# Altium schematic sheet Mach_do_dong phuong an cu.SchDoc: Mạch cảm biến dòng và áp
size A3; Address1: Lớp học; Address2: thiết kế PCB nâng cao; Address3: tại Elec2PCB.com; Address4: 0905912019; SheetNumber: 1; SheetTotal: 1
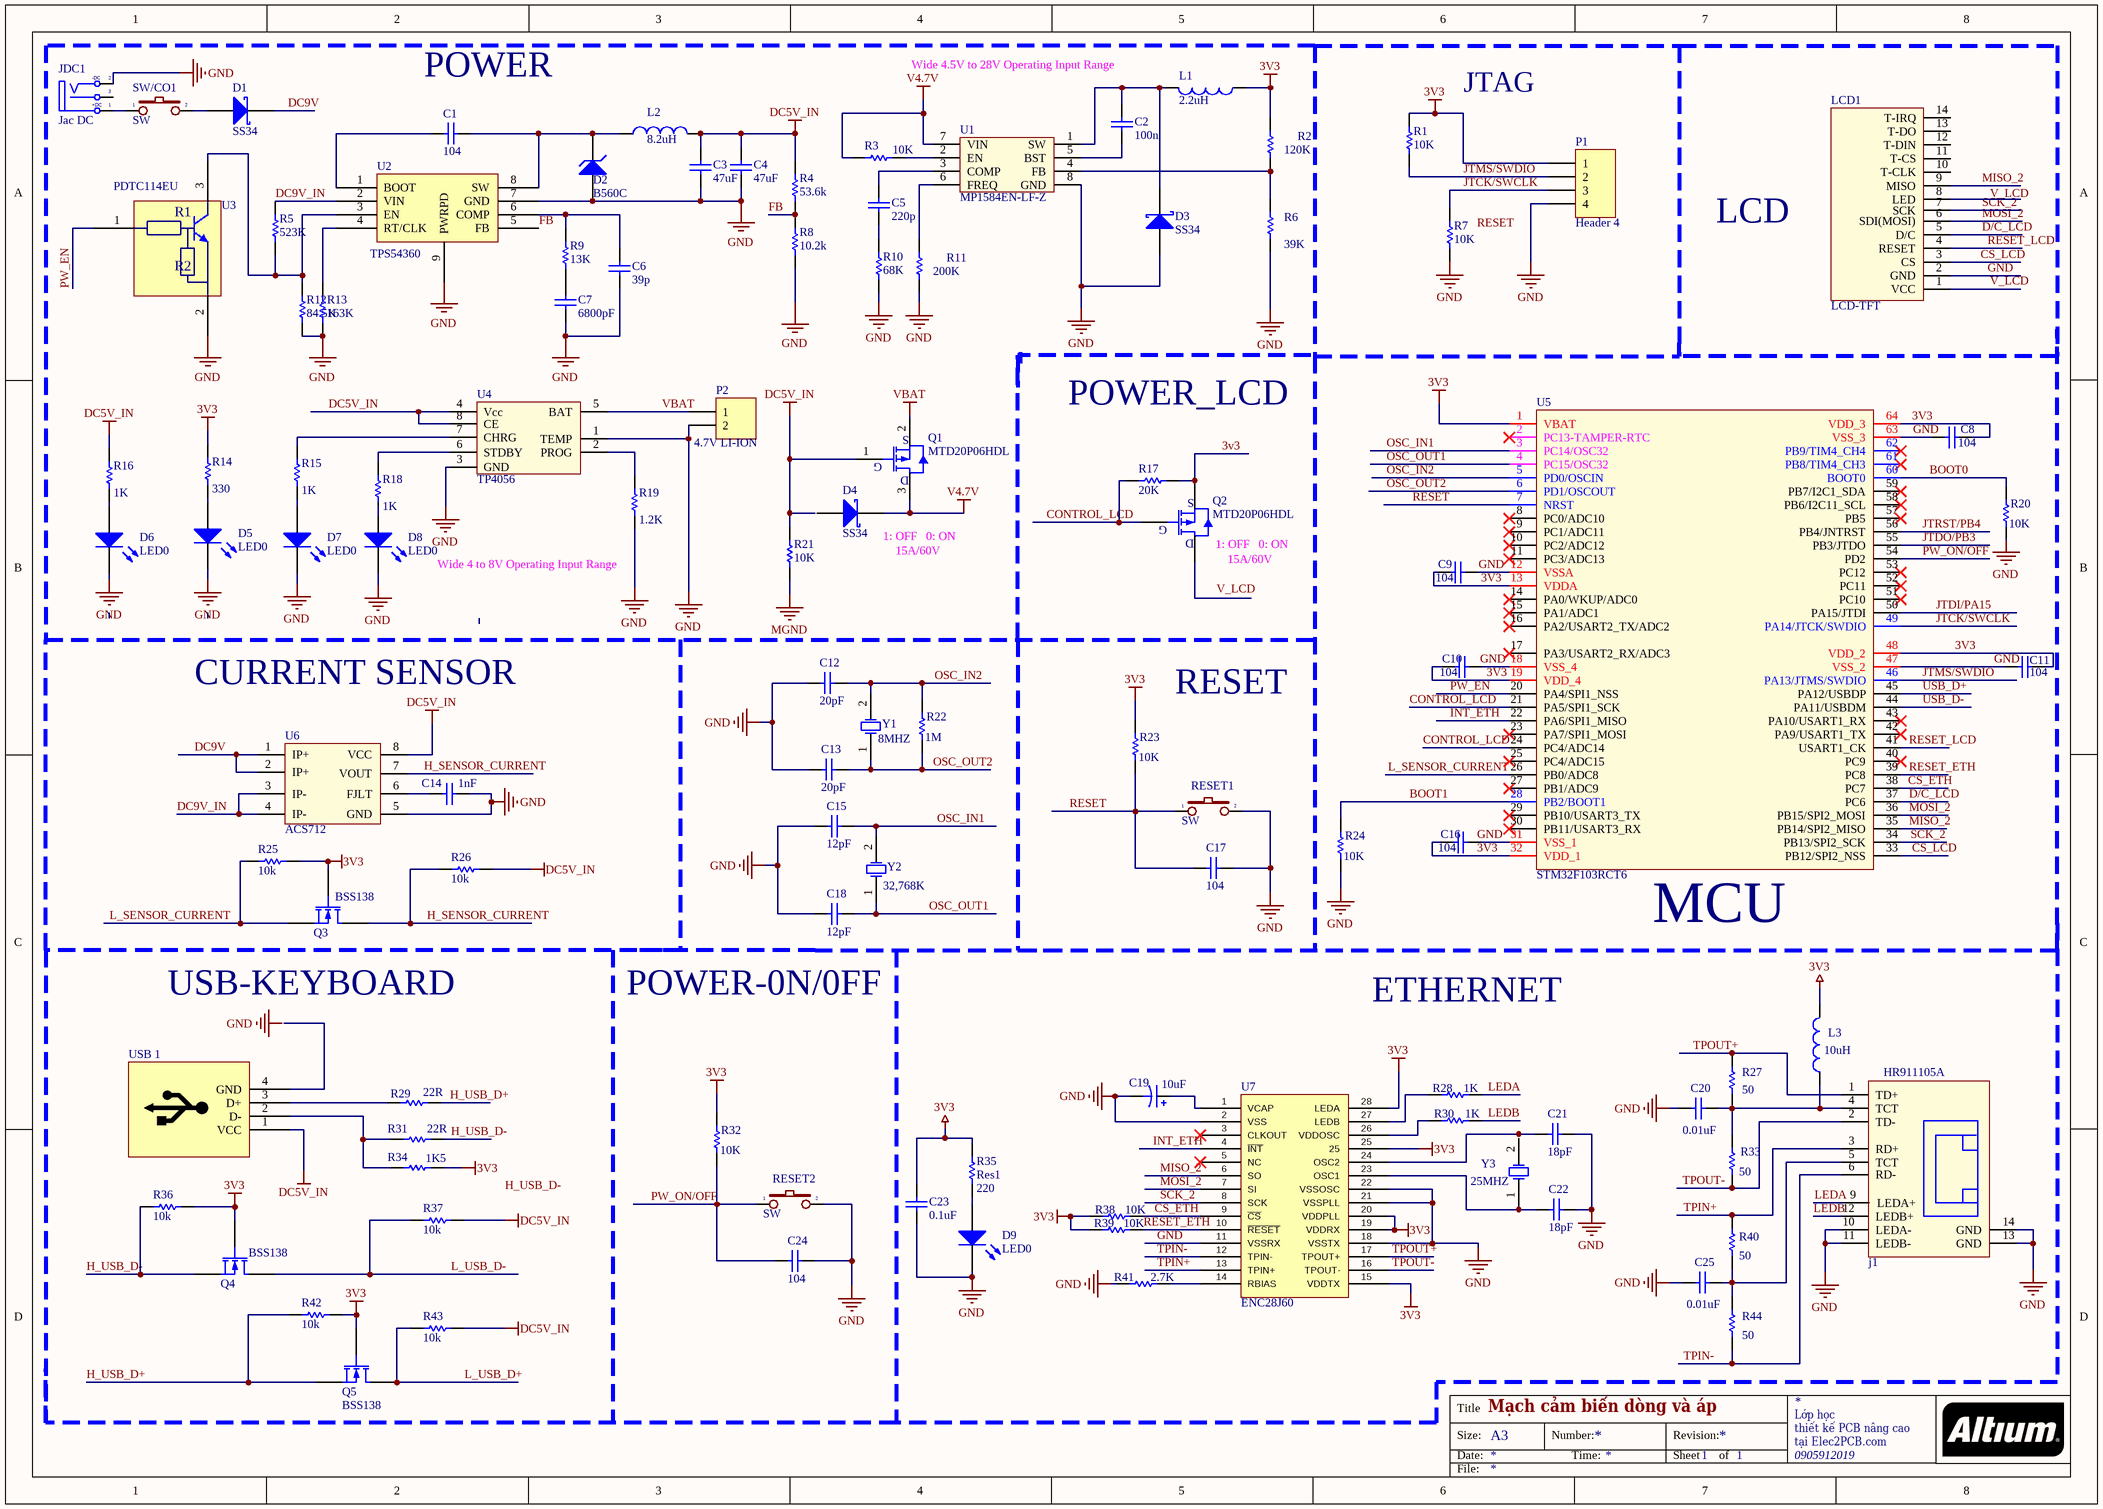
[diagram p0: Mach_do_dong phuong an cu.SchDoc]

## Parts
C1  value 104  [0805]  (hidden comment: Cap)
C2  value 100n  [RAD-0.3]  (hidden comment: Cap)
C3  value 47uF  [0805]  (hidden comment: Cap)
C4  value 47uF  [0805]  (hidden comment: Cap)
C5  value 220p  [RAD-0.3]  (hidden comment: Cap)
C6  value 39p  [0805]  (hidden comment: Cap)
C7  value 6800pF  [0805]  (hidden comment: Cap)
C8  value 104  [RAD-0.3]  (hidden comment: Cap)
C9  value 104  [RAD-0.3]  (hidden comment: Cap)
C10  value 104  [RAD-0.3]  (hidden comment: Cap)
C11  value 104  [RAD-0.3]  (hidden comment: Cap)
C12  value 20pF  [RAD-0.3]  (hidden comment: Cap)
C13  value 20pF  [RAD-0.3]  (hidden comment: Cap)
C14  value 1nF  [RAD-0.3]  (hidden comment: Cap)
C15  value 12pF  [RAD-0.3]  (hidden comment: Cap)
C16  value 104  [RAD-0.3]  (hidden comment: Cap)
C17  value 104  [RAD-0.3]  (hidden comment: Cap)
C18  value 12pF  [RAD-0.3]  (hidden comment: Cap)
C19  value 10uF  [RB7.6-15]  (hidden comment: Cap Pol1)
C20  value 0.01uF  [RAD-0.3]  (hidden comment: Cap)
C21  value 18pF  [RAD-0.3]  (hidden comment: Cap)
C22  value 18pF  [RAD-0.3]  (hidden comment: Cap)
C23  value 0.1uF  [RAD-0.3]  (hidden comment: Cap)
C24  value 104  [RAD-0.3]  (hidden comment: Cap)
C25  value 0.01uF  [RAD-0.3]  (hidden comment: Cap)
D1  SS34  [SMB]
D2  B560C  [D-SMC]
D3  SS34  [SMB]
D4  SS34  [SMB]
D5  LED0  [LED-0]
D6  LED0  [LED-0]
D7  LED0  [LED-0]
D8  LED0  [LED-0]
D9  LED0  [LED-0]
j1  HR911105A
JDC1  Jac DC  [DC-IN]
L1  value 2.2uH  [0402-A]  (hidden comment: Inductor)
L2  value 8.2uH  [L -smd]  (hidden comment: Inductor)
L3  value 10uH  [0402-A]  (hidden comment: Inductor)
LCD1  LCD-TFT
P1  Header 4  [HDR1X4]
P2  4.7V LI-ION  [HDR1X2]
Q1  MTD20P06HDL  [8# IRLML9301- TRPbF]
Q2  MTD20P06HDL  [8# IRLML9301- TRPbF]
Q3  BSS138  [E3]
Q4  BSS138  [E3]
Q5  BSS138  [E3]
R1  value 10K  [RESC2012(0805)]  (hidden comment: Res1)
R2  value 120K  [RESC2012(0805)]  (hidden comment: Res1)
R3  value 10K  [RESC2012(0805)]  (hidden comment: Res1)
R4  value 53.6k  [RESC2012(0805)]  (hidden comment: Res1)
R5  value 523K  [RESC2012(0805)]  (hidden comment: Res1)
R6  value 39K  [RESC2012(0805)]  (hidden comment: Res1)
R7  value 10K  [RESC2012(0805)]  (hidden comment: Res1)
R8  value 10.2k  [RESC2012(0805)]  (hidden comment: Res1)
R9  value 13K  [RESC2012(0805)]  (hidden comment: Res1)
R10  value 68K  [RESC2012(0805)]  (hidden comment: Res1)
R11  value 200K  [RESC2012(0805)]  (hidden comment: Res1)
R12  value 84.5K  [RESC2012(0805)]  (hidden comment: Res1)
R13  value 163K  [RESC2012(0805)]  (hidden comment: Res1)
R14  value 330  [RESC2012(0805)]  (hidden comment: Res1)
R15  value 1K  [RESC2012(0805)]  (hidden comment: Res1)
R16  value 1K  [RESC2012(0805)]  (hidden comment: Res1)
R17  value 20K  [RESC2012(0805)]  (hidden comment: Res1)
R18  value 1K  [RESC2012(0805)]  (hidden comment: Res1)
R19  value 1.2K  [RESC2012(0805)]  (hidden comment: Res1)
R20  value 10K  [RESC2012(0805)]  (hidden comment: Res1)
R21  10K  [Res 0603 SMD]
R22  value 1M  [RESC2012(0805)]  (hidden comment: Res1)
R23  value 10K  [RESC2012(0805)]  (hidden comment: Res1)
R24  value 10K  [RESC2012(0805)]  (hidden comment: Res1)
R25  value 10k  [RESC2012(0805)]  (hidden comment: Res1)
R26  value 10k  [RESC2012(0805)]  (hidden comment: Res1)
R27  value 50  [RESC2012(0805)]  (hidden comment: Res1)
R28  value 1K  [RESC2012(0805)]  (hidden comment: Res1)
R29  value 22R  [RESC2012(0805)]  (hidden comment: Res1)
R30  value 1K  [RESC2012(0805)]  (hidden comment: Res1)
R31  value 22R  [RESC2012(0805)]  (hidden comment: Res1)
R32  value 10K  [RESC2012(0805)]  (hidden comment: Res1)
R33  value 50  [RESC2012(0805)]  (hidden comment: Res1)
R34  value 1K5  [RESC2012(0805)]  (hidden comment: Res1)
R35  Res1  value 220  [RESC2012(0805)]
R36  value 10k  [RESC2012(0805)]  (hidden comment: Res1)
R37  value 10k  [RESC2012(0805)]  (hidden comment: Res1)
R38  value 10K  [RESC2012(0805)]  (hidden comment: Res1)
R39  value 10K  [RESC2012(0805)]  (hidden comment: Res1)
R40  value 50  [RESC2012(0805)]  (hidden comment: Res1)
R41  value 2.7K  [RESC2012(0805)]  (hidden comment: Res1)
R42  value 10k  [RESC2012(0805)]  (hidden comment: Res1)
R43  value 10k  [RESC2012(0805)]  (hidden comment: Res1)
R44  value 50  [RESC2012(0805)]  (hidden comment: Res1)
RESET1  SW  [SW2]
RESET2  SW  [SW2]
SW/CO1  SW  [SW2]
U1  MP1584EN-LF-Z
U2  TPS54360
U3  PDTC114EU
U4  TP4056
U5  STM32F103RCT6
U6  ACS712
U7  ENC28J60  [SOP_28M_127]
USB_1  USB  [USB-B-STRANGE]  (value not drawn)
Y1  8MHZ  [R38]
Y2  32,768K  [R38]
Y3  25MHZ  [R38]

## Nets
3V3: C8.2 C9.1 C10.1 C11.2 C16.1 C23.2 L1.1 L3.2 P1.1 Q2.2(S) Q3.2(G) Q4.2(G) Q5.2(G) R1.1 R2.1 R14.2 R17.2 R23.2 R25.2 R32.2 R34.1 R35.2 R36.2 R38.2 R39.2 R42.2 U5.1(VBAT) U5.13(VDDA) U5.19(VDD_4) U5.32(VDD_1) U5.48(VDD_2) U5.64(VDD_3) U7.15(VDDTX) U7.19(VDDRX) U7.20(VDDPLL) U7.25 U7.28(LEDA)
DC5V_IN: C3.1 C4.1 L2.2 Q1.1(G) R4.2 R16.2 R21.1 R26.2 R37.2 R43.2 U4.4(Vcc) U4.8(CE) U6.8(VCC) USB_1.1(VCC)
GND: C3.2 C4.2 C6.2 C7.2 C8.1 C9.2 C11.1 C12.1 C13.1 C14.2 C15.1 C17.2 C18.1 C19.2 C20.1 C21.1 C22.1 C23.1 C24.2 C25.1 D2.1(A) D3.1(A) D5.2(K) D6.2(K) D7.2(K) D8.2(K) D9.2(K) j1.10(LEDA-) j1.11(LEDB-) j1.13(GND) j1.14(GND) JDC1.2(TN) LCD1.2(GND) P1.4 P2.2 R6.2 R7.2 R8.1 R10.2 R11.2 R12.1 R13.1 R19.1 R20.1 R24.1 R41.2 RESET1.2 RESET2.2 U1.8(GND) U2.7(GND) U2.9(PWRPD) U3.2(GND) U4.1(TEMP) U4.3(GND) U5.12(VSSA) U5.47(VSS_2) U5.63(VSS_3) U6.5(GND) U7.2(VSS) U7.11(VSSRX) U7.18(VSSTX) U7.21(VSSPLL) U7.22(VSSOSC)
MGND: R21.2
V4.7V: D4.2(K) Q1.3(D) R3.2 U1.7(VIN)
VBAT: P2.1 Q1.2(S) U4.5(BAT)
BOOT0: R20.2 U5.60(BOOT0)
BOOT1: R24.2 U5.28(PB2/BOOT1)
CONTROL_LCD: Q2.1(G) R17.1 U5.21(PA5/SPI1_SCK) U5.24(PC4/ADC14)
CS_ETH: R38.1 U5.38(PC7) U7.9(~{CS})
CS_LCD: LCD1.3(CS) U5.33(PB12/SPI2_NSS)
D/C_LCD: LCD1.5(D/C) U5.37(PC6)
DC9V: D1.2(K) U6.1(IP+) U6.2(IP+)
DC9V_IN: R5.2 U2.2(VIN) U6.3(IP-) U6.4(IP-)
FB: R4.1 R8.2 U2.5(FB)
H_SENSOR_CURRENT: Q3.1(D) R26.1 U6.7(VOUT)
H_USB_D+: Q5.3(S) R29.1 R42.1
H_USB_D-: Q4.3(S) R31.1 R36.1
INT_ETH: U5.22(PA6/SPI1_MISO) U7.4(~{INT})
JTCK/SWCLK: P1.3 R7.1 U5.49(PA14/JTCK/SWDIO)
JTDI/PA15: U5.50(PA15/JTDI)
JTDO/PB3: U5.55(PB3/JTDO)
JTMS/SWDIO: P1.2 R1.2 U5.46(PA13/JTMS/SWDIO)
JTRST/PB4: U5.56(PB4/JNTRST)
L_SENSOR_CURRENT: Q3.3(S) R25.1 U5.26(PB0/ADC8)
L_USB_D+: Q5.1(D) R43.1
L_USB_D-: Q4.1(D) R37.1
LEDA: j1.9(LEDA+) R28.1
LEDB: j1.12(LEDB+) R30.1
MISO_2: LCD1.9(MISO) U5.35(PB14/SPI2_MISO) U7.6(SO)
MOSI_2: LCD1.6(SDI(MOSI)) U5.36(PB15/SPI2_MOSI) U7.7(SI)
OSC_IN1: C15.2 U5.3(PC14/OSC32) Y2.2(OSC2)
OSC_IN2: C12.2 R22.2 U5.5(PD0/OSCIN) Y1.2(OSC2)
OSC_OUT1: C18.2 U5.4(PC15/OSC32) Y2.1(OSC1)
OSC_OUT2: C13.2 R22.1 U5.6(PD1/OSCOUT) Y1.1(OSC1)
PW_EN: U3.1(input) U5.20(PA4/SPI1_NSS)
PW_ON/OFF: U5.54(PD2)
RESET: U5.7(NRST)
RESET_ETH: R39.1 U5.39(PC8) U7.10(~{RESET})
RESET_LCD: LCD1.4(RESET) U5.41(USART1_CK)
SCK_2: LCD1.7(SCK) U5.34(PB13/SPI2_SCK) U7.8(SCK)
TPIN+: j1.3(RD+) R40.2 U7.13(TPIN+)
TPIN-: j1.6(RD-) R44.1 U7.12(TPIN-)
TPOUT+: j1.1(TD+) R27.2 U7.17(TPOUT+)
TPOUT-: j1.2(TD-) R33.1 U7.16(TPOUT-)
USB_D+: U5.45(PA12/USBDP)
USB_D-: U5.44(PA11/USBDM)
V_LCD: LCD1.1(VCC)
NetC1_1: C1.1 D2.2(K) L2.1 U2.8(SW)
NetC1_2: C1.2 U2.1(BOOT)
NetC2_1: C2.1 U1.5(BST)
NetC2_2: C2.2 D3.2(K) L1.2 U1.1(SW)
NetC5_1: C5.1 U1.3(COMP)
NetC5_2: C5.2 R10.1
NetC6_1: C6.1 R9.2 U2.6(COMP)
NetC7_1: C7.1 R9.1
NetC10_2: C10.2 U5.18(VSS_4)
NetC14_1: C14.1 U6.6(FJLT)
NetC16_2: C16.2 U5.31(VSS_1)
NetC17_1: C17.1 R23.1 RESET1.1
NetC19_1: C19.1 U7.1(VCAP)
NetC21_2: C21.2 U7.24(OSC2)
NetC22_2: C22.2 U7.23(OSC1) Y3.1(OSC1)
NetC24_1: C24.1 R32.1 RESET2.1
NetC25_2: C25.2 j1.5(TCT) R40.1 R44.2
NetD1_1: D1.1(A) SW/CO1.2
NetD5_1: D5.1(A) R14.1
NetD6_1: D6.1(A) R16.1
NetD7_1: D7.1(A) R15.1
NetD8_1: D8.1(A) R18.1
NetD9_1: D9.1(A) R35.1
Netj1_4: j1.4(TCT) L3.1 R27.1 R33.2
NetJDC1_1: JDC1.1(T) SW/CO1.1
NetR2_2: R2.2 R6.1 U1.4(FB)
NetR3_1: R3.1 U1.2(EN)
NetR5_1: R5.1 R12.2 U2.3(EN) U3.3(output)
NetR11_1: R11.1 U1.6(FREQ)
NetR13_2: R13.2 U2.4(RT/CLK)
NetR15_2: R15.2 U4.7(CHRG)
NetR18_2: R18.2 U4.6(STDBY)
NetR19_2: R19.2 U4.2(PROG)
NetR28_2: R28.2 U7.27(LEDB)
NetR29_2: R29.2 USB_1.3(D+)
NetR30_2: R30.2 U7.26(VDDOSC)
NetR31_2: R31.2 R34.2 USB_1.2(D-)
NetR41_1: R41.1 U7.14(RBIAS)

Not connected (* = marked no-connect by the designer): C20 2; D4 1(A); JDC1 3(S); LCD1 8(LED) 10(T-CLK) 11(T-CS) 12(T-DIN) 13(T-DO) 14(T-IRQ); Q2 3(D); U5 2(PC13-TAMPER-RTC)* 8(PC0/ADC10)* 9(PC1/ADC11)* 10(PC2/ADC12)* 11(PC3/ADC13)* 14(PA0/WKUP/ADC0)* 15(PA1/ADC1)* 16(PA2/USART2_TX/ADC2)* 17(PA3/USART2_RX/ADC3)* 23(PA7/SPI1_MOSI)* 25(PC4/ADC15)* 27(PB1/ADC9)* 29(PB10/USART3_TX)* 30(PB11/USART3_RX)* 40(PC9)* 42(PA9/USART1_TX)* 43(PA10/USART1_RX)* 51(PC10)* 52(PC11)* 53(PC12)* 57(PB5)* 58(PB6/I2C11_SCL)* 59(PB7/I2C1_SDA)* 61(PB8/TIM4_CH3)* 62(PB9/TIM4_CH4)*; U7 3(CLKOUT)* 5(NC)*; USB_1 4(GND) 5 6; Y3 2(OSC2)

## Notes on the sheet
- (near C1) POWER
- Wide 4.5V to 28V Operating Input Range
- JTAG
- LCD
- POWER_LCD
- Wide 4 to 8V Operating Input Range
- (near D4) 1: OFF   0: ON
- 15A/60V
- (near Q2) 1: OFF   0: ON
- (near Q2) 15A/60V
- CURRENT SENSOR
- (near R23) RESET
- (near U5) MCU
- (near Q3) USB-KEYBOARD
- (near C18) POWER-0N/0FF
- ETHERNET
- Labels drawn without touching a wire or pin: GND, H_USB_D-, RESET, V_LCD
- Title
- Size:
- Date:
- A3
- Number:
- Time:
- Revision:
- Sheet
- of
- File:
- (in symbol DCIN) -DC; +DC
- (in symbol PDTC114EU) R1; R2

## Library data of the parts
C1-C18 C20-C25 = Cap: Capacitor; Published: 8-Jun-2000; LatestRevisionDate: 17-Jul-2002; LatestRevisionNote: Re-released for DXP Platform.; PackageReference: RAD-0.3; Publisher: Altium Limited
  C2 C5 C8-C18 C20-C25: PackageDescription: Radial Cap, Thru-Hole; 2 Leads; 0.3 in Pin Spacing
C19 = Cap Pol1: Polarized Capacitor (Radial); Published: 8-Jun-2000; LatestRevisionDate: 17-Jul-2002; LatestRevisionNote: Re-released for DXP Platform.; PackageReference: RB7.6-15; Publisher: Altium Limited; PackageDescription: Polarized Capacitor (Radial); 2 Leads
D1 D3 D4 = D Schottky: Schottky Diode; Published: 8-Jun-2000; LatestRevisionDate: 17-Jul-2002; LatestRevisionNote: Re-released for DXP Platform.; PackageReference: SMB; Publisher: Altium Limited; PackageDescription: DO-214-AA/SMB; 2 C-Bend Leads; Body 5.3 x 3.6 mm, inc. leads (LxW); Code_JEDEC: DO-214-AA
D2 = D Zener: Zener Diode; Published: 8-Jun-2000; LatestRevisionDate: 17-Jul-2002; LatestRevisionNote: Re-released for DXP Platform.; PackageReference: DIODE-0.7; Publisher: Altium Limited
D5-D9 = LED0: Typical INFRARED GaAs LED; Published: 8-Jun-2000; LatestRevisionDate: 08-Jul-2005; LatestRevisionNote: Mech Layer 1 removed.; PackageReference: LED-0; Publisher: Altium Limited; PackageDescription: LED; 2 Leads
j1 = HR911105A: Ethernet Connector
JDC1 = DCIN: Jac DC input; Value: Jac DC
L1-L3 = Inductor: Code_IEC: 1005; Published: 8-Jun-2000; LatestRevisionDate: 29-May-2009; LatestRevisionNote: IPC-7351 Footprint Added.; PackageReference: 0402-A; Publisher: Altium Limited; PackageDescription: Chip Inductor; Code_JEITA: 0402
P1 = Header 4: Header, 4-Pin; LatestRevisionDate: 17-Jul-2002; LatestRevisionNote: Re-released for DXP Platform.; Publisher: Altium Limited
P2 = Header 2: Header, 2-Pin; LatestRevisionDate: 17-Jul-2002; LatestRevisionNote: Re-released for DXP Platform.; Publisher: Altium Limited
Q1 Q2 = 8#IRLML9301TRPBF: MOSFET MOSFT P-Ch -60V -15A; Manufacturer: International Rectifier; Rds On Max: 64mR; Input Capacitance: 388pF; Rise Time: 19ns; Recovery Time: 21ns; Nominal Vgs: -1.3V; Number of Elements: 1; Max Power Dissipation: 1.3W; Drain to Source Voltage (Vdss): 30V; Continuous Drain Current (ID): 3.6A; Gate to Source Voltage (Vgs): 20V; Drain to Source Resistance: 103mR; Turn-On Delay Time: 9.6ns; Turn-Off Delay Time: 16ns; Fall Time: 15ns; Element Configuration: Single; Drain to Source Breakdown Voltage: -30V; Manufacturer Part Number: IRLML9301TRPBF; Mount: Surface Mount; Case/Package: SOT-23; Number of Pins: 3; Min Operating Temperature: -55°C; Max Operating Temperature: 150°C; Packaging: Tape and Reel; Package Quantity: 1; Power Dissipation: 1.3W; Threshold Voltage: -1.3V; On-State Resistance: 64MR; Length: 3.04mm; Height: 1.02mm; Width: 1.4mm; Radiation Hardening: No; REACH SVHC: No SVHC; Lead Free: Lead Free; Supplier 1: Farnell; Supplier Part Number 1: 1829137
Q3-Q5 = MOSFET-N: N-Channel MOSFET; Published: 8-Jun-2000; LatestRevisionDate: 17-Jul-2002; LatestRevisionNote: Re-released for DXP Platform.; PackageVersion: 1995/1996; PackageReference: E3; Publisher: Altium Limited; PackageDescription: TO, Flat Index; 3 In-Line, Axial Leads; Body Dia. 4.6mm; Lead Dia. 0.5 mm (max)
R1-R20 R22-R44 = Res1: Resistor; Published: 8-Jun-2000; LatestRevisionDate: 17-Jul-2002; LatestRevisionNote: Re-released for DXP Platform.; PackageReference: AXIAL-0.3; Publisher: Altium Limited
  R1-R3 R6 R7 R10 R11 R14-R20 R22-R44: PackageDescription: Axial Device, Thru-Hole; 2 Leads; 0.3 in Pin Spacing
R21 = 10K/R0603/1%: RES SMD 10K OHM 1% 1/10W 0603; Manufacturer: Yageo; Manufacturer Part Number: RC0603FR-0710KL; Power (Watts): 0.1W, 1/10W; Temperature Coefficient: ±100ppm/°C; Supplier 1: Digi-Key; RoHS: RoHS Compliant; Category: Resistors; Stock 1: 11440000; Pricing 1: 5000=0.00167, 10000=0.00145, 25000=0.00128, 50000=0.00117, 125000=0.00115 (USD); Packaging: Tape & Reel (TR); Resistance (Ohms): 10k; Tolerance: ±1%; Composition: Thick Film; Features: Moisture Resistant; Operating Temperature: -55°C ~ 155°C; Package / Case: 0603 (1608 Metric); Supplier Device Package: 0603; Size / Dimension: 0.063" L x 0.031" W (1.60mm x 0.80mm); Height: 0.022" (0.55mm); Number of Terminations: 2; ComponentLink1URL: http://www.yageo.com/NewPortal/yageodocoutput?fileName=/pdf/R-Chip/PYu-RC_Group_51_RoHS_L_3.pdf; ComponentLink1Description: http://www.yageo.com/NewPortal/yageodocoutput?fileName=/pdf/R-Chip/PYu-RC_Group_51_RoHS_L_3.pdf; Supplier Part Number 1: 311-10.0KHRTR-ND
RESET1 RESET2 SW/CO1 = SW2: Switch button 2 pin; Value: SW chip 2 pin
U1 = MP1584EN-LF-Z: 3A, 1.5HZ, 28V Step-Down Converter
U6 = ACS712: Current Sensor
U7 = ENC28J60: Stand-Alone Ethernet Controller with SPI Interface
USB_1 = USB_MH: USB conector
Y1-Y3 = XTAL: Crystal Oscillator; Published: 8-Jun-2000; LatestRevisionDate: 17-Jul-2002; LatestRevisionNote: Re-released for DXP Platform.; PackageReference: R38; Publisher: Altium Limited; PackageDescription: Crystal, Thru-Hole; 2 Leads; Body 3.1 x 8.2 mm (Dia.xH)